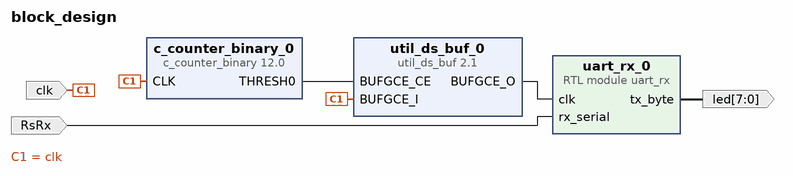
[diagram p0: block diagram of the top level]
# Vivado block design block_design, xc7a35tcpg236-1, Vivado 2020.2
create_bd_design block_design

create_bd_port -dir I -type clk clk
set_property -dict {CONFIG.FREQ_HZ 100000000} [get_bd_ports clk]
create_bd_port -dir I -type data RsRx
create_bd_port -dir O -from 7 -to 0 -type data led

create_bd_cell -type module -reference uart_rx uart_rx_0
create_bd_cell -type ip -vlnv xilinx.com:ip:util_ds_buf:2.1 util_ds_buf_0
set_property -dict {CONFIG.C_BUF_TYPE BUFGCE} [get_bd_cells util_ds_buf_0]
create_bd_cell -type ip -vlnv xilinx.com:ip:c_counter_binary:12.0 c_counter_binary_0
set_property -dict [list \
  CONFIG.Final_Count_Value 28a \
  CONFIG.Restrict_Count true \
  CONFIG.Sync_Threshold_Output true \
  CONFIG.Threshold_Value 28a \
] [get_bd_cells c_counter_binary_0]

# ---- connections ----

connect_bd_net [get_bd_ports RsRx] [get_bd_pins uart_rx_0/rx_serial]
connect_bd_net [get_bd_pins uart_rx_0/tx_byte] [get_bd_ports led]
connect_bd_net [get_bd_ports clk] [get_bd_pins util_ds_buf_0/BUFGCE_I] [get_bd_pins c_counter_binary_0/CLK]
connect_bd_net [get_bd_pins c_counter_binary_0/THRESH0] [get_bd_pins util_ds_buf_0/BUFGCE_CE]
connect_bd_net [get_bd_pins util_ds_buf_0/BUFGCE_O] [get_bd_pins uart_rx_0/clk]

validate_bd_design
save_bd_design
